# Altium project Project.PrjPcb
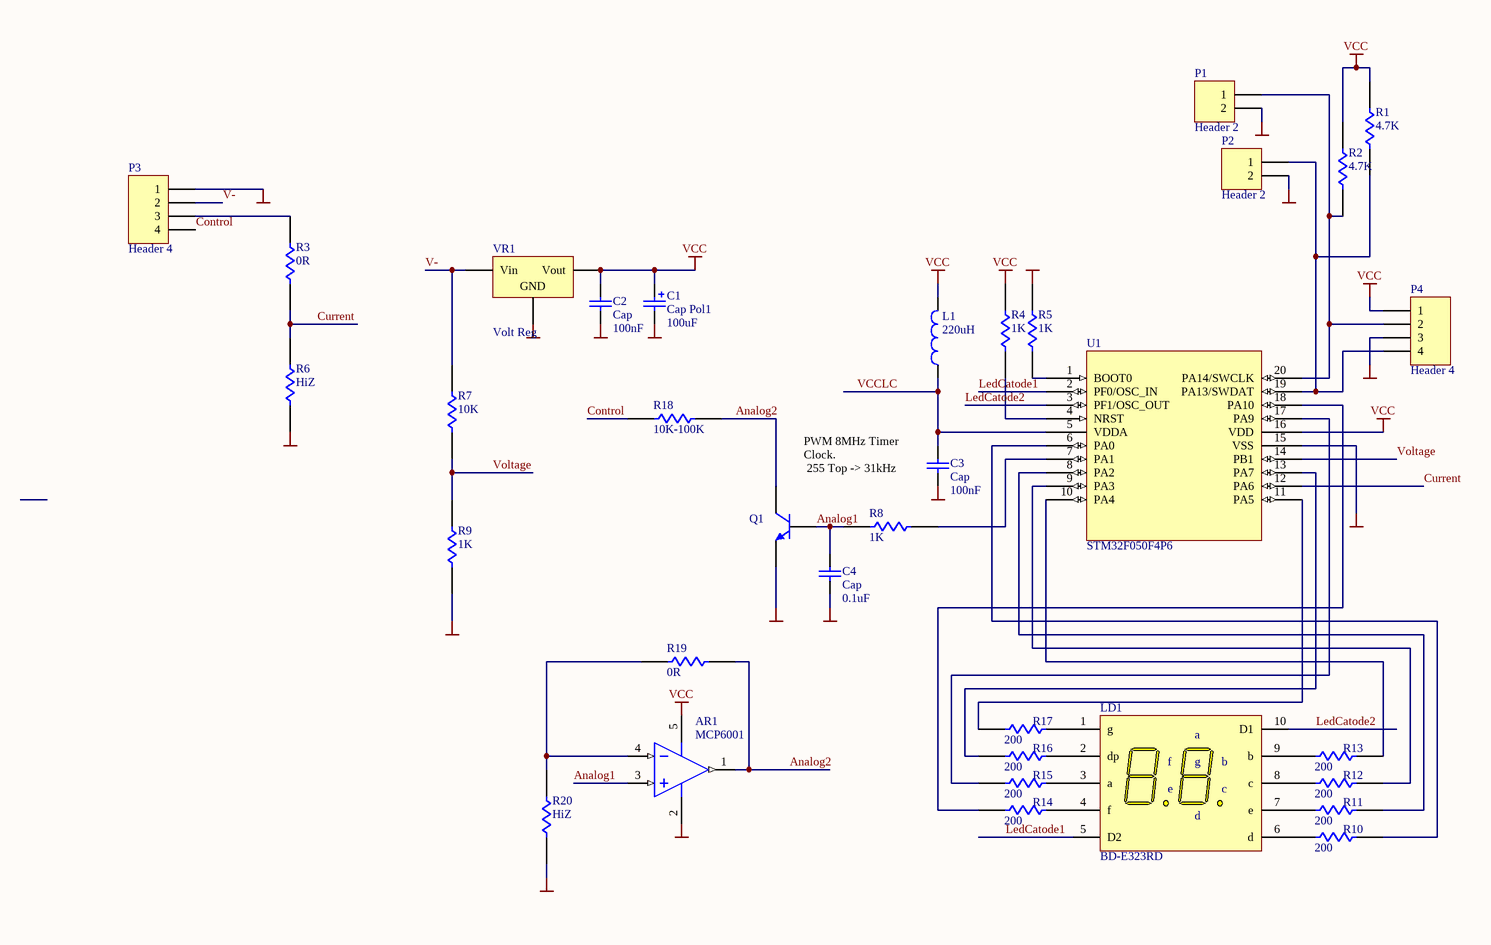
[diagram p0: Sheet1.SchDoc]
1 sheet, 34 parts. Net scope: global (net labels, ports and power ports of the same name join across sheets).
Board file: PCB1.PcbDoc

## Sheet Sheet1.SchDoc
size A3; PageSetup: Record=PageOptions|CenterHorizontal=True|CenterVertical=True|PrintScale=1.00|XCorrection=1.00|YCorrection=1.00|PrintKind=1|BorderSize=5000000|LeftOffset=0|BottomOffset=0|Orientation=2|PaperLength=1000|PaperWidth=1000|Scale=100|PaperSource=7|PrintQuality=-4|MediaType=1|DitherType=10|PaperKind=A2 420 x 594 мм|PrintScaleMode=1

### Parts
AR1  MCP6001  [SOT23-5_M]
C1  Cap Pol1  value 100uF  [RAD-0.3]
C2  Cap  value 100nF  [6-0805_M]
C3  Cap  value 100nF  [6-0805_M]
C4  Cap  value 0.1uF  [6-0805_M]
L1  value 220uH  [INDC4532]  (hidden comment: Inductor)
LD1  BD-E323RD  [DD-04]
P1  Header 2  [HDR1X2]
P2  Header 2  [HDR1X2]
P3  Header 4  [HDR1X4]
P4  Header 4  [HDR1X4]
Q1  NPN_SIGNAL  [SOT23_M]  (value not drawn)
R1  4.7K  [6-0805_M]
R2  4.7K  [6-0805_M]
R3  0R  [6-0805_M]
R4  1K  [6-0805_M]
R5  1K  [6-0805_M]
R6  HiZ  [6-0805_M]
R7  10K  [6-0805_M]
R8  1K  [6-0805_M]
R9  1K  [6-0805_M]
R10  200  [6-0805_M]
R11  200  [6-0805_M]
R12  200  [6-0805_M]
R13  200  [6-0805_M]
R14  200  [6-0805_M]
R15  200  [6-0805_M]
R16  200  [6-0805_M]
R17  200  [6-0805_M]
R18  10K-100K  [6-0805_M]
R19  0R  [6-0805_M]
R20  HiZ  [6-0805_M]
U1  STM32F050F4P6  [TSOP20]
VR1  Volt Reg  [DPAK]

### Nets
GND: AR1.2(GND) C1.2 C2.1 C3.1 C4.1 P1.2 P2.2 P3.1 P4.3 Q1.2(E) R5.1 R6.2 R9.2 R20.1 U1.15(VSS) VR1.2(GND)
VCC: AR1.5(V+) C1.1 C2.2 L1.2 P4.1 R1.1 R2.1 R4.1 U1.16(VDD) VR1.3(Vout)
Analog1: AR1.3(IN+) C4.2 Q1.1(B) R8.1
Analog2: AR1.1(OUT) Q1.3(C) R18.2 R19.2
Control: P3.4 R18.1
Current: R3.2 R6.1 U1.12(PA6)
LedCatode1: LD1.5(D2) U1.2(PF0/OSC_IN)
LedCatode2: LD1.10(D1) U1.3(PF1/OSC_OUT)
V-: P3.2 R7.1 VR1.1(Vin)
VCCLC: C3.2 L1.1 U1.5(VDDA)
Voltage: R7.2 R9.1 U1.14(PB1)
NetAR1_4: AR1.4(IN-) R19.1 R20.2
NetLD1_1: LD1.1(g) R17.2
NetLD1_2: LD1.2(dp) R16.2
NetLD1_3: LD1.3(a) R15.2
NetLD1_4: LD1.4(f) R14.2
NetLD1_6: LD1.6(d) R10.1
NetLD1_7: LD1.7(e) R11.1
NetLD1_8: LD1.8(c) R12.1
NetLD1_9: LD1.9(b) R13.1
NetP1_1: P1.1 P4.2 R2.2 U1.20(PA14/SWCLK)
NetP2_1: P2.1 P4.4 R1.2 U1.19(PA13/SWDAT)
NetP3_3: P3.3 R3.1
NetR4_2: R4.2 U1.4(NRST)
NetR5_2: R5.2 U1.1(BOOT0)
NetR8_2: R8.2 U1.7(PA1)
NetR10_2: R10.2 U1.6(PA0)
NetR11_2: R11.2 U1.8(PA2)
NetR12_2: R12.2 U1.9(PA3)
NetR13_2: R13.2 U1.10(PA4)
NetR14_1: R14.1 U1.18(PA10)
NetR15_1: R15.1 U1.17(PA9)
NetR16_1: R16.1 U1.13(PA7)
NetR17_1: R17.1 U1.11(PA5)

### Notes on the sheet
- PWM 8MHz Timer Clock.
  255 Top -> 31kHz

### Library data of the parts
AR1 = MCP6001: FET Operational Amplifier; Published: 8-Jun-2000; LatestRevisionDate: 17-Jul-2002; LatestRevisionNote: Re-released for DXP Platform.; DatasheetVersion: REV. B; PackageVersion: 1990; PackageReference: H-08A; Publisher: Altium Limited; PackageDescription: Can; 8 Leads; Pin Circle Dia. 5.08 mm; Lead Dia. 0.53 mm (max); ComponentLink1Description: Manufacturer Link; ComponentLink1URL: http://www.analog.com/
C1 = Cap Pol1: Polarized Capacitor (Radial); Published: 8-Jun-2000; LatestRevisionDate: 17-Jul-2002; LatestRevisionNote: Re-released for DXP Platform.; PackageReference: RB7.6-15; Publisher: Altium Limited; PackageDescription: Polarized Capacitor (Radial); 2 Leads
C2-C4 = Cap: Capacitor; Published: 8-Jun-2000; LatestRevisionDate: 17-Jul-2002; LatestRevisionNote: Re-released for DXP Platform.; PackageReference: RAD-0.3; Publisher: Altium Limited; PackageDescription: Radial Cap, Thru-Hole; 2 Leads; 0.3 in Pin Spacing
L1 = Inductor: Code_IEC: 1005; Published: 8-Jun-2000; LatestRevisionDate: 29-May-2009; LatestRevisionNote: IPC-7351 Footprint Added.; PackageReference: 0402-A; Publisher: Altium Limited; PackageDescription: Chip Inductor; Code_JEITA: 0402
P1 P2 = Header 2: Header, 2-Pin; LatestRevisionDate: 17-Jul-2002; LatestRevisionNote: Re-released for DXP Platform.; Publisher: Altium Limited
P3 P4 = Header 4: Header, 4-Pin; LatestRevisionDate: 17-Jul-2002; LatestRevisionNote: Re-released for DXP Platform.; Publisher: Altium Limited
Q1 = NPN_SIGNAL: Low power NPN transistor
R1-R20 = Resistor: Published: 24-Mar-1999; LatestRevisionDate: 29-May-2009; LatestRevisionNote: IPC-7351 Footprint Added.; PackageVersion: Mar-2003; PackageReference: 6-0805; Publisher: Altium Limited; PackageDescription: Chip Resistor 0805 Case Size; Code_IPC: RESC2012
U1 = STM32F050F4P6: STM32 ARM-based 32-bit MCU with 16 Kbytes Flash, 20-pin; Published: 30-May-2008; DatasheetVersion: rev6, Mar-2008; PackageVersion: Mar-2008; PackageReference: LQFP48; Publisher: Altium Limited; PackageDescription: 48-Pin Low-Profile Quad Flat Pack, 7 x 7 mm Body, 0.5 mm Pitch (LQFP48); ComponentLink1Description: Manufacturer Link; ComponentLink1URL: www.st.com/stm32; ComponentLink2Description: Datasheet; ComponentLink2URL: http://www.st.com/stonline/products/literature/ds/13586.pdf
VR1 = Volt Reg: Voltage Regulator; Published: 24-Mar-1999; LatestRevisionDate: 29-May-2009; LatestRevisionNote: IPC-7351 Footprint Added.; PackageReference: D2PAK; Publisher: Altium Limited; PackageDescription: 3-Pin Transistor Outline Package 2.54 mm Pitch, 15.1 mm Lead Span